# EAGLE schematic OdomBoard (EAGLE 9.6.2)

## Sheet 1 of 3
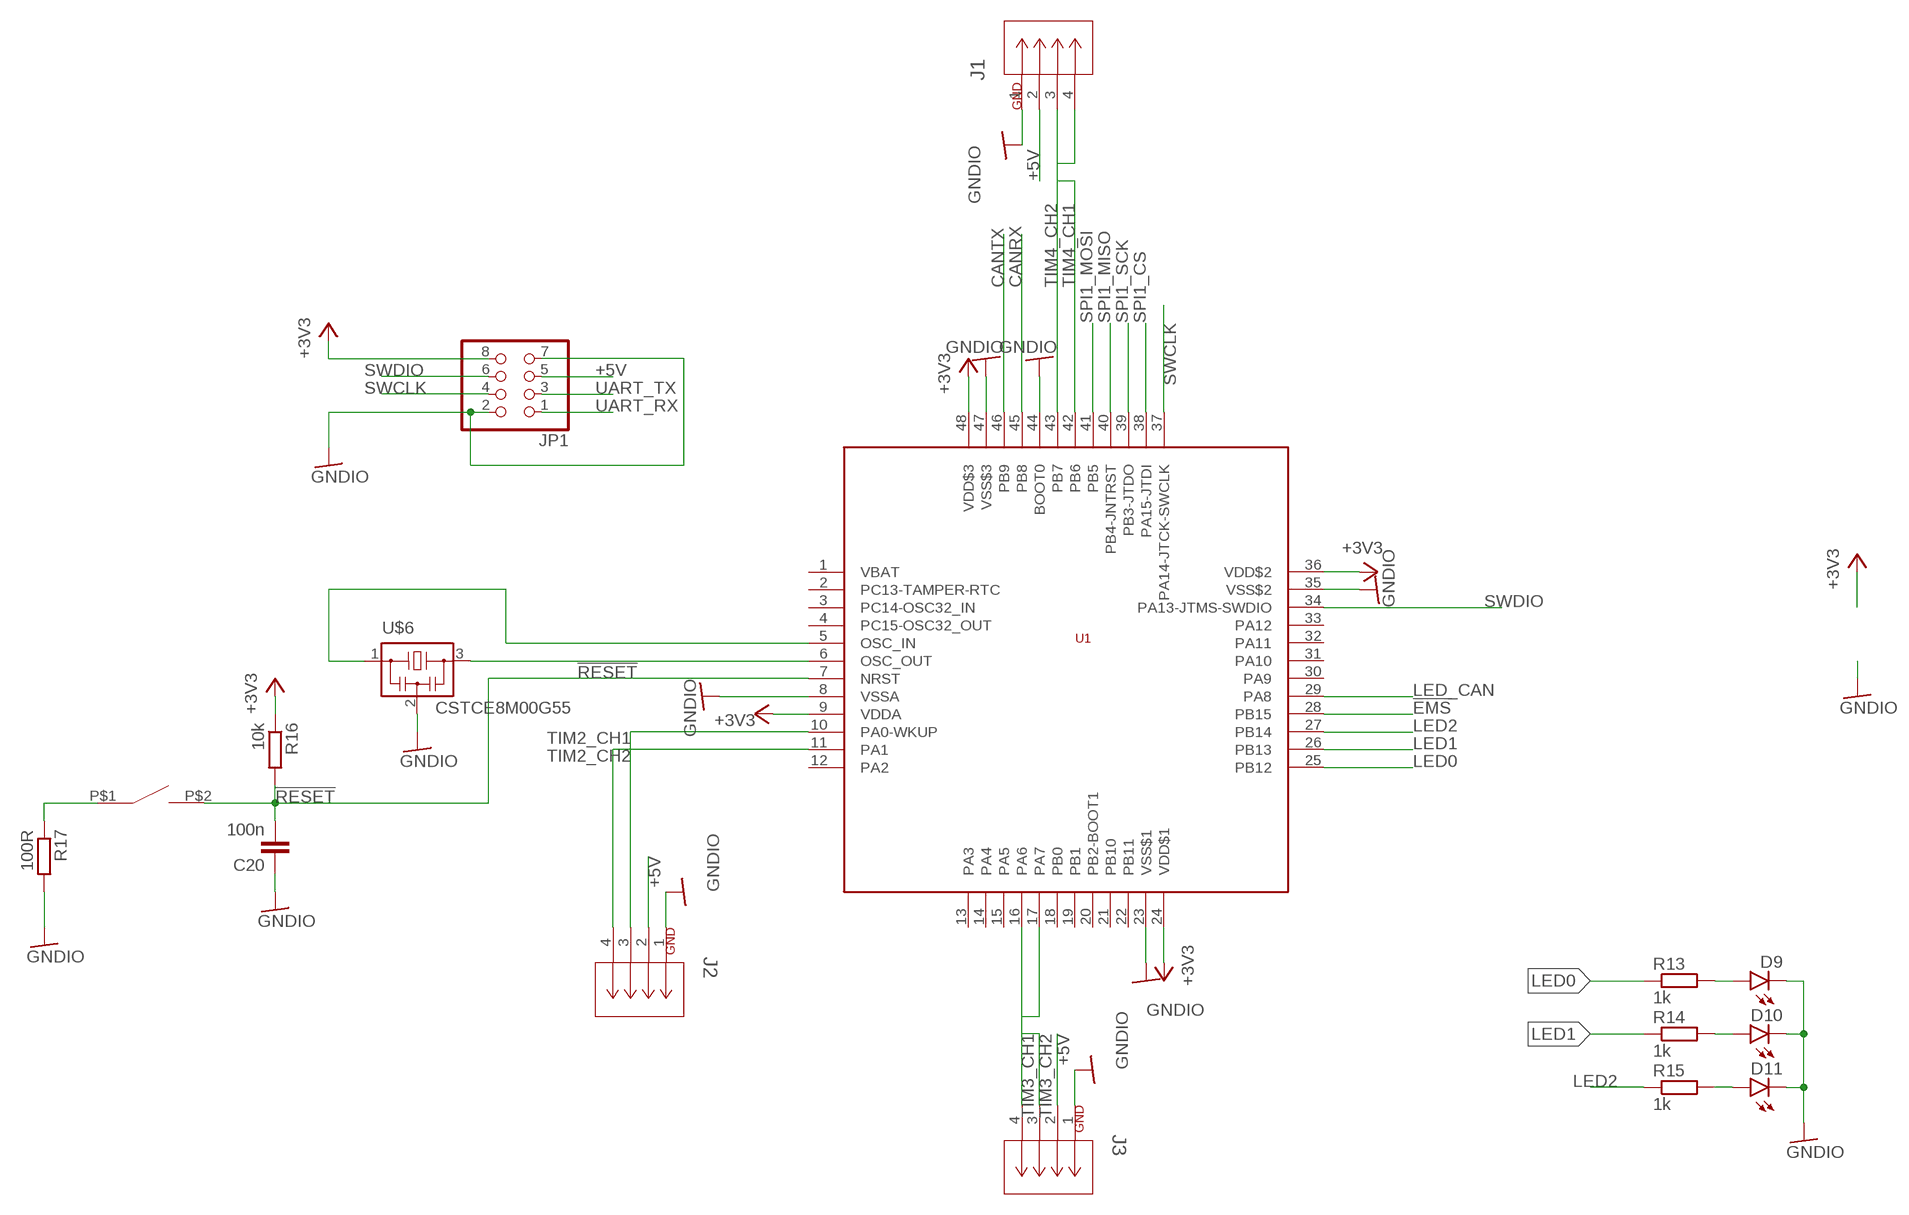
[diagram p0: schematic, sheet 1]

### Parts
C20  100n  C-EUC0603  [C0603]
D9  LEDCHIPLED_0805  [CHIPLED_0805]
D10  LEDCHIPLED_0805  [CHIPLED_0805]
D11  LEDCHIPLED_0805  [CHIPLED_0805]
J1  EP2.5-4-SIDE  [CONN4_1744426-4]
J2  EP2.5-4-SIDE  [CONN4_1744426-4]
J3  EP2.5-4-SIDE  [CONN4_1744426-4]
JP1  PINHD-2X4  [2X04]
R13  1k  R-EU_R0603  [R0603]
R14  1k  R-EU_R0603  [R0603]
R15  1k  R-EU_R0603  [R0603]
R16  10k  R-EU_R0603  [R0603]
R17  100R  R-EU_R0603  [R0603]
SW1  SWITCH_TACTILETOP  [SWITCH_TACTILE_3X6]
U1  STM32F103C8  [LQFP48]
U$6  CSTCE8M00G55  [CSTCE8M00G55]

### Nets
!EMS: U1.28(PB15) ; also sheet 3
!RESET: C20.2 R16.2 SW1.P$2 U1.7(NRST)
+3V3: JP1.8 R16.1 U1.9(VDDA) U1.24(VDD$1) U1.36(VDD$2) U1.48(VDD$3) ; also sheet 2
+5V: J1.2 J2.2 J3.2 JP1.5 ; also sheet 2,3
CANRX: U1.45(PB8) ; also sheet 3
CANTX: U1.46(PB9) ; also sheet 3
GNDIO: C20.1 D9.C D10.C D11.C J1.1 J2.1 J3.1 JP1.2 JP1.7 R17.2 U1.8(VSSA) U1.23(VSS$1) U1.35(VSS$2) U1.44(BOOT0) U1.47(VSS$3) U$6.2 ; also sheet 2,3
LED0: R13.1 U1.25(PB12)
LED1: R14.1 U1.26(PB13)
LED2: R15.1 U1.27(PB14)
LED_CAN: U1.29(PA8) ; also sheet 3
N$9: D10.A R14.2
N$10: D9.A R13.2
N$11: U1.6(OSC_OUT) U$6.3
N$16: R17.1 SW1.P$1
N$19: U1.5(OSC_IN) U$6.1
N$21: D11.A R15.2
SPI1_CS: U1.38(PA15-JTDI)
SPI1_MISO: U1.40(PB4-JNTRST)
SPI1_MOSI: U1.41(PB5)
SPI1_SCK: U1.39(PB3-JTDO)
SWCLK: JP1.4 U1.37(PA14-JTCK-SWCLK)
SWDIO: JP1.6 U1.34(PA13-JTMS-SWDIO)
TIM2_CH1: J2.3 U1.10(PA0-WKUP)
TIM2_CH2: J2.4 U1.11(PA1)
TIM3_CH1: J3.4 U1.17(PA7)
TIM3_CH2: J3.3 U1.16(PA6)
TIM4_CH1: J1.3 U1.42(PB6)
TIM4_CH2: J1.4 U1.43(PB7)
UART_RX: JP1.1
UART_TX: JP1.3
Unconnected: U1.1(VBAT) U1.2(PC13-TAMPER-RTC) U1.3(PC14-OSC32_IN) U1.4(PC15-OSC32_OUT) U1.12(PA2) U1.13(PA3) U1.14(PA4) U1.15(PA5) U1.18(PB0) U1.19(PB1) U1.20(PB2-BOOT1) U1.21(PB10) U1.22(PB11) U1.30(PA9) U1.31(PA10) U1.32(PA11) U1.33(PA12)

## Sheet 2 of 3
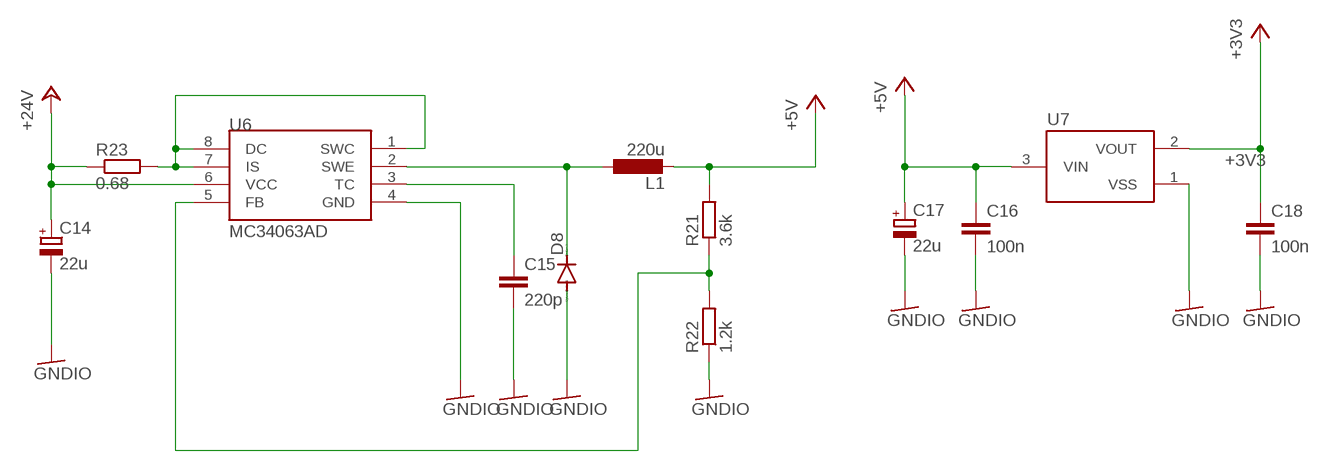
[diagram p1: schematic, sheet 2]

### Parts
C14  22u  CPOL-EUE2-5  [E2-5]
C15  220p  C-EUC0603  [C0603]
C16  100n  C-EUC0603  [C0603]
C17  22u  CPOL-EUE2-5  [E2-5]
C18  100n  C-EUC0603  [C0603]
D8  DIODE-SOD123  [SOD123]
L1  220u  L5852  [L5852]
R21  3.6k  R-EU_R0603  [R0603]
R22  1.2k  R-EU_R0603  [R0603]
R23  0.68  R-EU_R1206  [R1206]
U6  MC34063AD  [SOIC8]
U7  XC6206  [SOT95P240X110-3]

### Nets
+3V3: C18.1 U7.2(VOUT) ; also sheet 1
+5V: C16.1 C17.+ L1.P$2 R21.2 U7.3(VIN) ; also sheet 1,3
+24V: C14.+ R23.1 U6.6(VCC) ; also sheet 3
GNDIO: C14.- C15.2 C16.2 C17.- C18.2 D8.A R22.1 U6.4(GND) U7.1(VSS) ; also sheet 1,3
N$13: R23.2 U6.1(SWC) U6.7(IS) U6.8(DC)
N$14: D8.C L1.P$1 U6.2(SWE)
N$15: C15.1 U6.3(TC)
N$17: R21.1 R22.2 U6.5(FB)

## Sheet 3 of 3
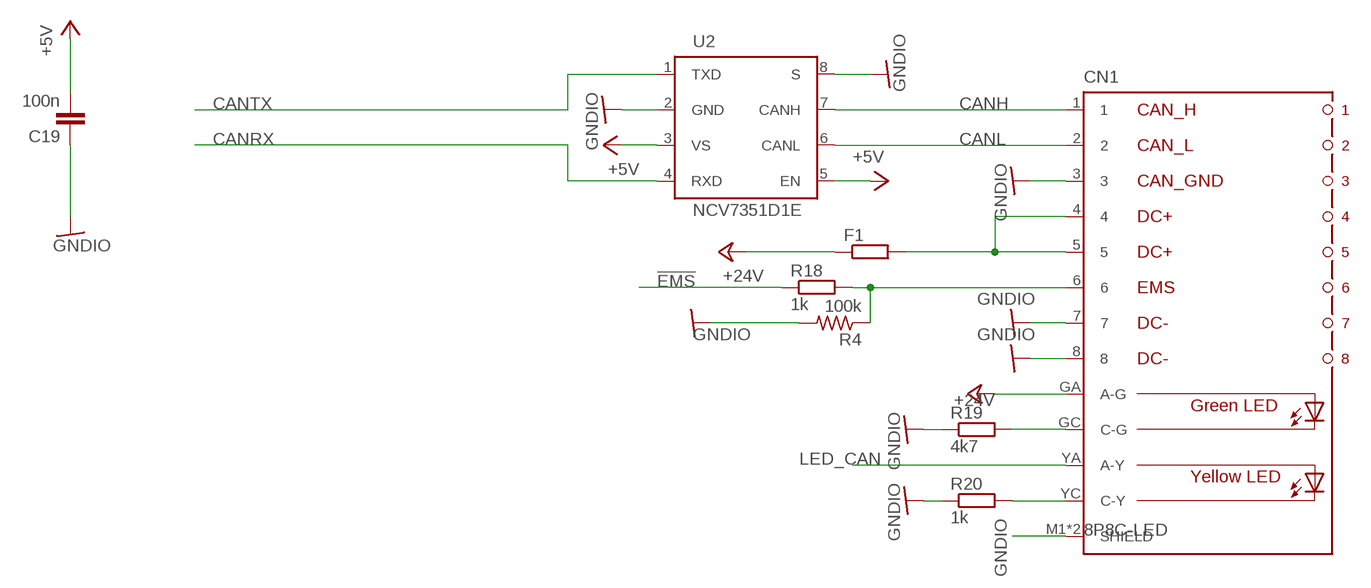
[diagram p2: schematic, sheet 3]

### Parts
C19  100n  C-EUC0603  [C0603]
CN1  8P8C-LED  [8P8C-LED]
F1  R-EU_R1206  [R1206]
R4  100k  R-US_R0603  [R0603]
R18  1k  R-EU_R0603  [R0603]
R19  4k7  R-EU_R0603  [R0603]
R20  1k  R-EU_R0603  [R0603]
U2  NCV7351D1E  [SO08]

### Nets
!EMS: R18.1 ; also sheet 1
+5V: C19.2 U2.3(VS) U2.5(EN) ; also sheet 1,2
+24V: CN1.GA(A-G) F1.1 ; also sheet 2
CANH: CN1.1 U2.7(CANH)
CANL: CN1.2 U2.6(CANL)
CANRX: U2.4(RXD) ; also sheet 1
CANTX: U2.1(TXD) ; also sheet 1
GNDIO: C19.1 CN1.3 CN1.7 CN1.8 CN1.M1(SHIELD) CN1.M2(SHIELD) R4.2 R19.1 R20.1 U2.2(GND) U2.8(S) ; also sheet 1,2
LED_CAN: CN1.YA(A-Y) ; also sheet 1
N$12: CN1.4 CN1.5 F1.2
N$18: CN1.YC(C-Y) R20.2
N$22: CN1.GC(C-G) R19.2
N$38: CN1.6 R4.1 R18.2

## Library data of the parts
C14 C17 = rcl:CPOL-EU: POLARIZED CAPACITOR, European symbol
C15 = rcl:C-EU: CAPACITOR, European symbol; SPICEPREFIX: C
C16 C18-C20 = rcl:C-EU: CAPACITOR, European symbol
CN1 = con-rj45:8P8C-LED: generic 8P8C connector with two LED's; OC_FARNELL: unknown; OC_NEWARK: unknown
D8 = diode:DIODE-: DIODE
D9-D11 = led:LED: LED OSRAM: - CHIPLED LG R971, LG N971, LY N971, LG Q971, LY Q971, LO R971, LY R971 LH N974, LH R974 LS Q976, LO Q976, LY Q976 LO Q996 - Hyper CHIPLED LW Q18S LB Q993, LB Q99A, LB R99A - SideLED LS A670, LO A670, LY A670, LG A670, LP A670 LB A673, LV A673, LT A673, LW A673 LH A674 LY A675 LS A676, LA A676, LO A676, LY A676, LW A676 LS A679, LY A679, LG A679 - Hyper Micro SIDELED® LS Y876, LA Y876, LO Y876, LY Y876 LT Y87S - SmartLED LW L88C, LW L88S LB L89C, LB L89S, LG L890 LS L89K, LO L89K, LY L89K LS L896, LA L896, LO L896, LY L896 - TOPLED LS T670, LO T670, LY T670, LG T670, LP T670 LSG T670, LSP T670, LSY T670, LOP T670, LYG T670 LG T671, LOG T671, LSG T671 LB T673, LV T673, LT T673, LW T673 LH T674 LS T676, LA T676, LO T676, LY T676, LB T676, LH T676, LSB T676, LW T676 LB T67C, LV T67C, LT T67C, LS T67K, LO T67K, LY T67K, LW E67C LS E67B, LA E67B, LO E67B, LY E67B, LB E67C, LV E67C, LT E67C LW T67C LS T679, LY T679, LG T679 LS T770, LO T770, LY T770, LG T770, LP T770 LB T773, LV T773, LT T773, LW T773 LH T774 LS E675, LA E675, LY E675, LS T675 LS T776, LA T776, LO T776, LY T776, LB T776 LHGB T686 LT T68C, LB T68C - Hyper Mini TOPLED® LB M676 - Mini TOPLED Santana® LG M470 LS M47K, LO M47K, LY M47K Source: http://www.osram.convergy.de LUXEON: - LUMILED® LXK2-PW12-R00, LXK2-PW12-S00, LXK2-PW14-U00, LXK2-PW14-V00 LXK2-PM12-R00, LXK2-PM12-S00, LXK2-PM14-U00 LXK2-PE12-Q00, LXK2-PE12-R00, LXK2-PE12-S00, LXK2-PE14-T00, LXK2-PE14-U00 LXK2-PB12-K00, LXK2-PB12-L00, LXK2-PB12-M00, LXK2-PB14-N00, LXK2-PB14-P00, LXK2-PB14-Q00 LXK2-PR12-L00, LXK2-PR12-M00, LXK2-PR14-Q00, LXK2-PR14-R00 LXK2-PD12-Q00, LXK2-PD12-R00, LXK2-PD12-S00 LXK2-PH12-R00, LXK2-PH12-S00 LXK2-PL12-P00, LXK2-PL12-Q00, LXK2-PL12-R00 Source: www.luxeon.com KINGBRIGHT: KA-3528ASYC Source: www.kingbright.com
F1 R18-R23 = rcl:R-EU_: RESISTOR, European symbol; SPICEPREFIX: R
J1-J3 = con-ep2.5:EP2.5-4-SIDE; MANUFACTURER_PART_NUMBER: 17444264; VENDOR: TE Connectivity
JP1 = pinhead:PINHD-2X4: PIN HEADER
L1 = l_ysk:L5852
R4 = rcl:R-US_: RESISTOR, American symbol; SPICEPREFIX: R
R13-R17 = rcl:R-EU_: RESISTOR, European symbol
SW1 = switch-tactile:SWITCH_TACTILE
U1 = stm32_mcu:STM32F103C8: STMicroelectronics STM32F103C8 Mainstream Performance line, ARM Cortex-M3 MCU with 64 Kbytes Flash, 72 MHz CPU, motor control, USB and CAN references: datasheet <https://www.st.com/resource/en/datasheet/stm32f103c8.pdf> product page <https://www.st.com/ja/microcontrollers/stm32f103c8.html>
U2 = on-semi:NCV7351D1E: High Speed CAN Transceiver Source: NCV7351-D.PDF <http://www.onsemi.com/PowerSolutions/document/NCV7351-D.PDF>
U6 = mc34063:MC34063
U7 = torex:XC6206
U$6 = resonator:CSTCE8M00G55